# EAGLE schematic LM2596 (EAGLE 9.1.3)

## Sheet 1 of 2
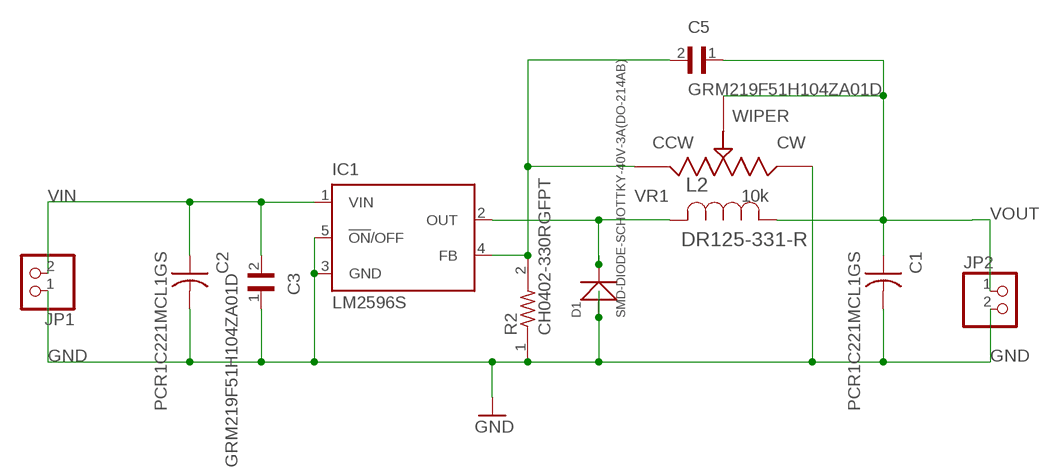
[diagram p0: schematic, sheet 1]

### Parts
C1  PCR1C221MCL1GS  [CAPE830X690N]
C2  PCR1C221MCL1GS  [CAPE830X690N]
C3  GRM219F51H104ZA01D  [CAPC2012X135N]
C5  GRM219F51H104ZA01D  [CAPC2012X135N]
D1  SMD-DIODE-SCHOTTKY-40V-3A(DO-214AB)  [DO-214AB]
IC1  LM2596S  [TO263-5]
JP1  PINHD-1X2/90  [1X02/90]
JP2  PINHD-1X2/90  [1X02/90]
L2  DR125-331-R  [INDM125125X600N]
R2  CH0402-330RGFPT  [RESC1005X40]
VR1  10k  3296W-1-103LF  [W]

### Nets
GND: C1.2(-) C2.2(-) C3.1 D1.1(+) IC1.3(GND) IC1.5(!ON!/OFF) JP1.1 JP2.2 R2.1 VR1.3
N$1: D1.2(-) IC1.2(OUT) L2.2
N$2: C5.2 IC1.4(FB) R2.2 VR1.1
VIN: C2.1(+) C3.2 IC1.1(VIN) JP1.2
VOUT: C1.1(+) C5.1 JP2.1 L2.1 VR1.2

## Sheet 2 of 2

## Library data of the parts
C1 C2 = PCR1C221MCL1GS:PCR1C221MCL1GS: 220uF 16V Polymer Aluminium Electrolytic Capacitor, CR Series 4000h 8.3x8.3x6.9mm; AVAILABILITY: Unavailable; DESCRIPTION: 220uF 16V Polymer Aluminium Electrolytic Capacitor, CR Series 4000h 8.3x8.3x6.9mm; MF: Nichicon; MP: PCR1C221MCL1GS; PACKAGE: Radial Nichicon; PRICE: None
C3 C5 = GRM219F51H104ZA01D:GRM219F51H104ZA01D: CAPACITOR, 0805, 100NF, Y5V; AVAILABILITY: Good; DESCRIPTION: Capacitor: ceramic; MLCC; 100nF; 50V; Y5V; -20÷+80%; SMD; 0805; MF: Murata Electronics; MP: GRM219F51H104ZA01D; PACKAGE: 0805 Murata; PRICE: 0.04 USD
D1 = SMD-DIODE-SCHOTTKY-40V-3A_DO-214AB_:SMD-DIODE-SCHOTTKY-40V-3A(DO-214AB): 304020018; DESCRIPTION: Rectifier, Schottky; DO-214AB; 3.0A IF; 0.75V; 40V; 100A IFRM; 10000V/us; 1000pF; DIGI-KEY_PART_NUMBER: SS34-E3/57TGICT-ND; DIGI-KEY_PURCHASE_URL: https://www.digikey.ma/product-detail/en/vishay-semiconductor-diodes-division/SS34-E3-57T/SS34-E3-57TGICT-ND/1091684?utm_source=snapeda&utm_medium=aggregator&utm_campaign=symbol; MF: Vishay; MP: SS34-E3/57T; PACKAGE: DO-214 Vishay
IC1 = national-semiconductor:LM2596: SIMPLE SWITCHER® Power Converter 150 kHz 3A Step-Down Voltage Regulator Source: http://www.national.com/ds/LM/LM2596.pdf; MF: NATIONAL SEMICONDUCTOR; MPN: LM2596S-ADJ/NOPB; OC_FARNELL: 9494367; OC_NEWARK: 41K3842
JP1 JP2 = pinhead:PINHD-1X2: PIN HEADER
L2 = DR125-331-R:DR125-331-R: POWER INDUCTOR; AVAILABILITY: Unavailable; DESCRIPTION: Inductor Power Shielded Drum Core 332.6u_OCL_H/330uH 20% 100KHz Ferrite 1.06A 482mOhm DCR T/R; MF: Eaton; MP: DR125-331-R; PACKAGE: Nonstandard Eaton; PRICE: None
R2 = CH0402-330RGFPT:CH0402-330RGFPT: Res Thin Film 0402 330 Ohm 2% 1/20W ±100ppm/°C Molded SMD Paper T/R; AVAILABILITY: Bad; DESCRIPTION: Res Thin Film 0402 330 Ohm 2% 1/20W ±100ppm/°C Molded SMD Paper T/R; MF: Vishay; MP: CH0402-330RGFPT; PACKAGE: 0402 Vishay; PRICE: 3.75 USD
VR1 = 3296W:3296?-*: Trim Potentiometer (Pot) Documentation Datasheet <http://www.bourns.com/data/global/pdfs/3296.pdf> Features Multiturn/Cermet/Industrial/Sealed 5 terminal styles Tape and reel packaging Chevron seal design Listed on the QPL for style RJ24 per MIL-R_22097 and RJR24 per High-Rel Mil-R-39035 Mounting hardware available (H-117P) RoHS compliant* version available For trimmer applications/processing guidelines, click here <http://www.bourns.com/data/global/pdfs/ap_proc.pdf>; ADJUSTMENT_TYPE: Tope Adjustment; CATEGORY: Potentiometers, Variable Resistors; DESCRIPTION: TRIMMER 10K OHM 0.5W PC PIN; DOCUMENTATION_LINK: <a href="http://www.bourns.com/data/global/pdfs/3296.pdf">Datasheet</a>; DOCUMENTATION_URL: http://www.bourns.com/data/global/pdfs/3296.pdf; FAMILY: Trimmer Potentiometers; MANUFACTURER: Bourns Inc; MOUNTING_TYPE: Through Hole; NUMBER_OF_TURNS: 25; PART_NUMBER: 3296W-1-103LF; POWER: 0.5W, 1/2W; RESISTANCE: 10k; RESISTIVE_MATERIAL: Cermet; SERIES: Trimpt 3296 - Sealed; SIZE: Rectangular - 0.375" x 0.190" Face x 0.395" H (9.53mm x 4.83mm x 10.03mm); STANDARD_PACKAGE: 50; SUPPLIER_ITEM_LINK: <a href="http://www.digikey.com/product-detail/en/3296W-1-103LF/3296W-103LF-ND/1088045">Details</a>; SUPPLIER_ITEM_NUMBER: 3296W-103LF-ND; SUPPLIER_ITEM_URL: http://www.digikey.com/product-detail/en/3296W-1-103LF/3296W-103LF-ND/1088045; SUPPLIER_LINK: <a href="http://www.digikey.com">Home Page</a>; SUPPLIER_NAME: Digi-Key; SUPPLIER_URL: http://www.digikey.com; TEMPERATURE_COEFFICIENT: 100ppm/C; TERMINATION_STYLE: PC Pin; TOLERANCE: 10%

## Net classes
0 default: width 0.4 mm, drill 0.6 mm, clearance 0.3 mm